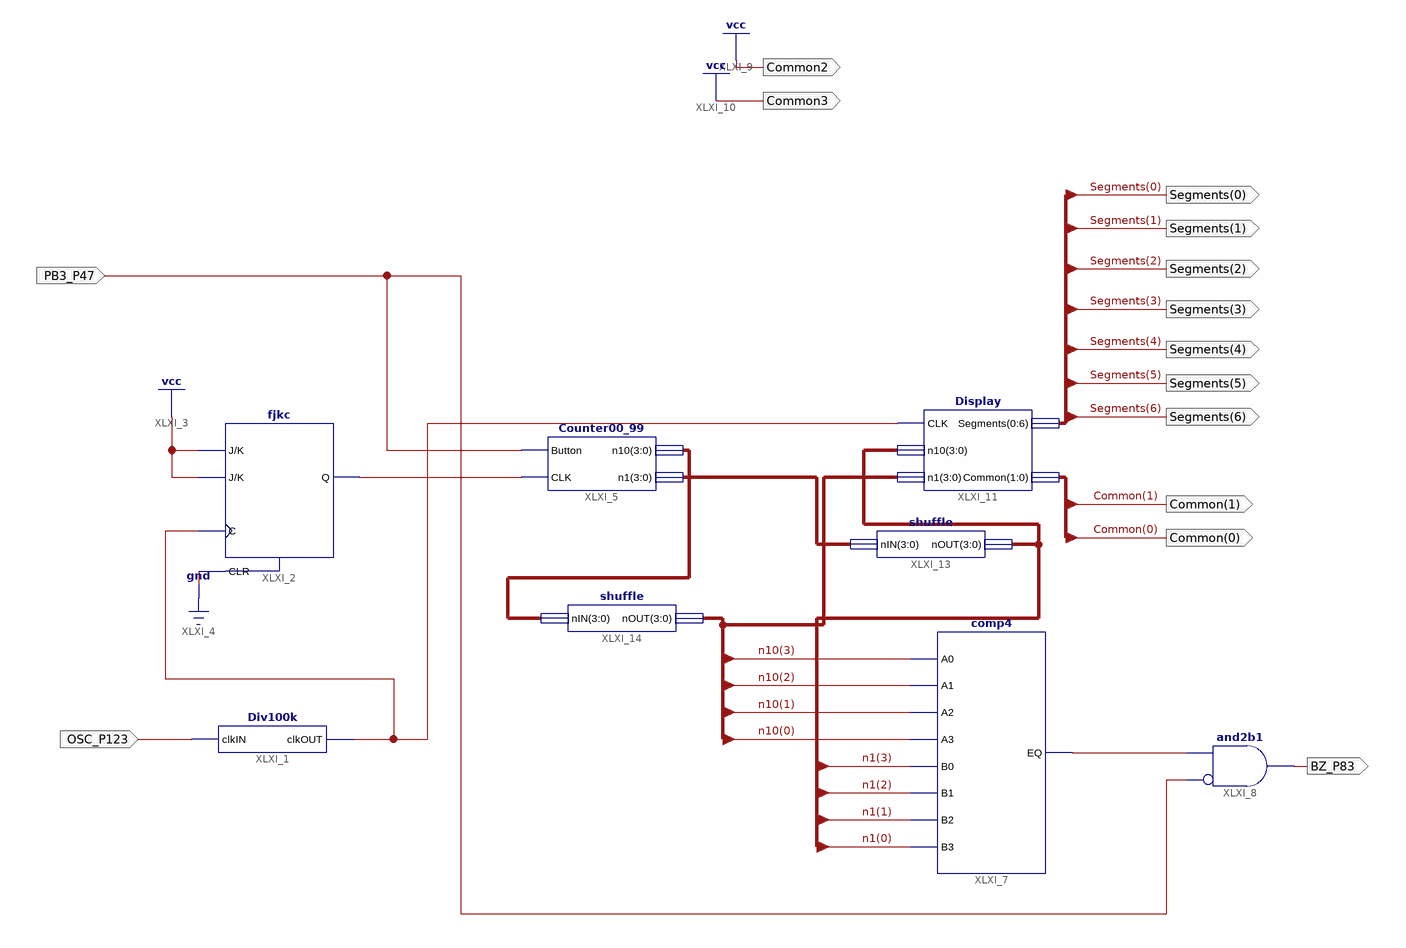
[diagram p0: schematic sheet 1]
// Xilinx ISE schematic Lab6.sch (spartan6) as structural Verilog: 8 symbols, 14 ports
module Lab6 (
  input  OSC_P123,
  input  PB3_P47,
  output [6:0] Segments,
  output [1:0] Common,
  output Common2,
  output Common3,
  output BZ_P83
);

  wire XLXN_5, XLXN_6, XLXN_17;
  wire [3:0] n1, n2, n10, XLXN_25;

  Div100k XLXI_1 (.clkIN(OSC_P123), .clkOUT(XLXN_5));
  fjkc XLXI_2 (.C(XLXN_5), .CLR(1'b0), .J(1'b1), .K(1'b1), .Q(XLXN_6));
  Counter00_99 XLXI_5 (.CLK(XLXN_6), .Button(PB3_P47), .n10(XLXN_25), .n1(n2));
  comp4 XLXI_7 (
    .A0(n10[3]), .A1(n10[2]), .A2(n10[1]), .A3(n10[0]), .B0(n1[3]), .B1(n1[2]), .B2(n1[1]), .B3(n1[0]),
    .EQ(XLXN_17));
  and XLXI_8 (BZ_P83, ~PB3_P47, XLXN_17);  // and2b1
  Display XLXI_11 (
    .CLK(XLXN_5), .n10(n1), .n1(n10),
    .Segments({Segments[0], Segments[1], Segments[2], Segments[3], Segments[4], Segments[5], Segments[6]}),
    .Common(Common));
  shuffle XLXI_13 (.nIN(n2), .nOUT(n1));
  shuffle XLXI_14 (.nIN(XLXN_25), .nOUT(n10));

  assign Common2 = 1'b1;
  assign Common3 = 1'b1;
endmodule
